# EAGLE schematic ab_sch (EAGLE 6.6.0)
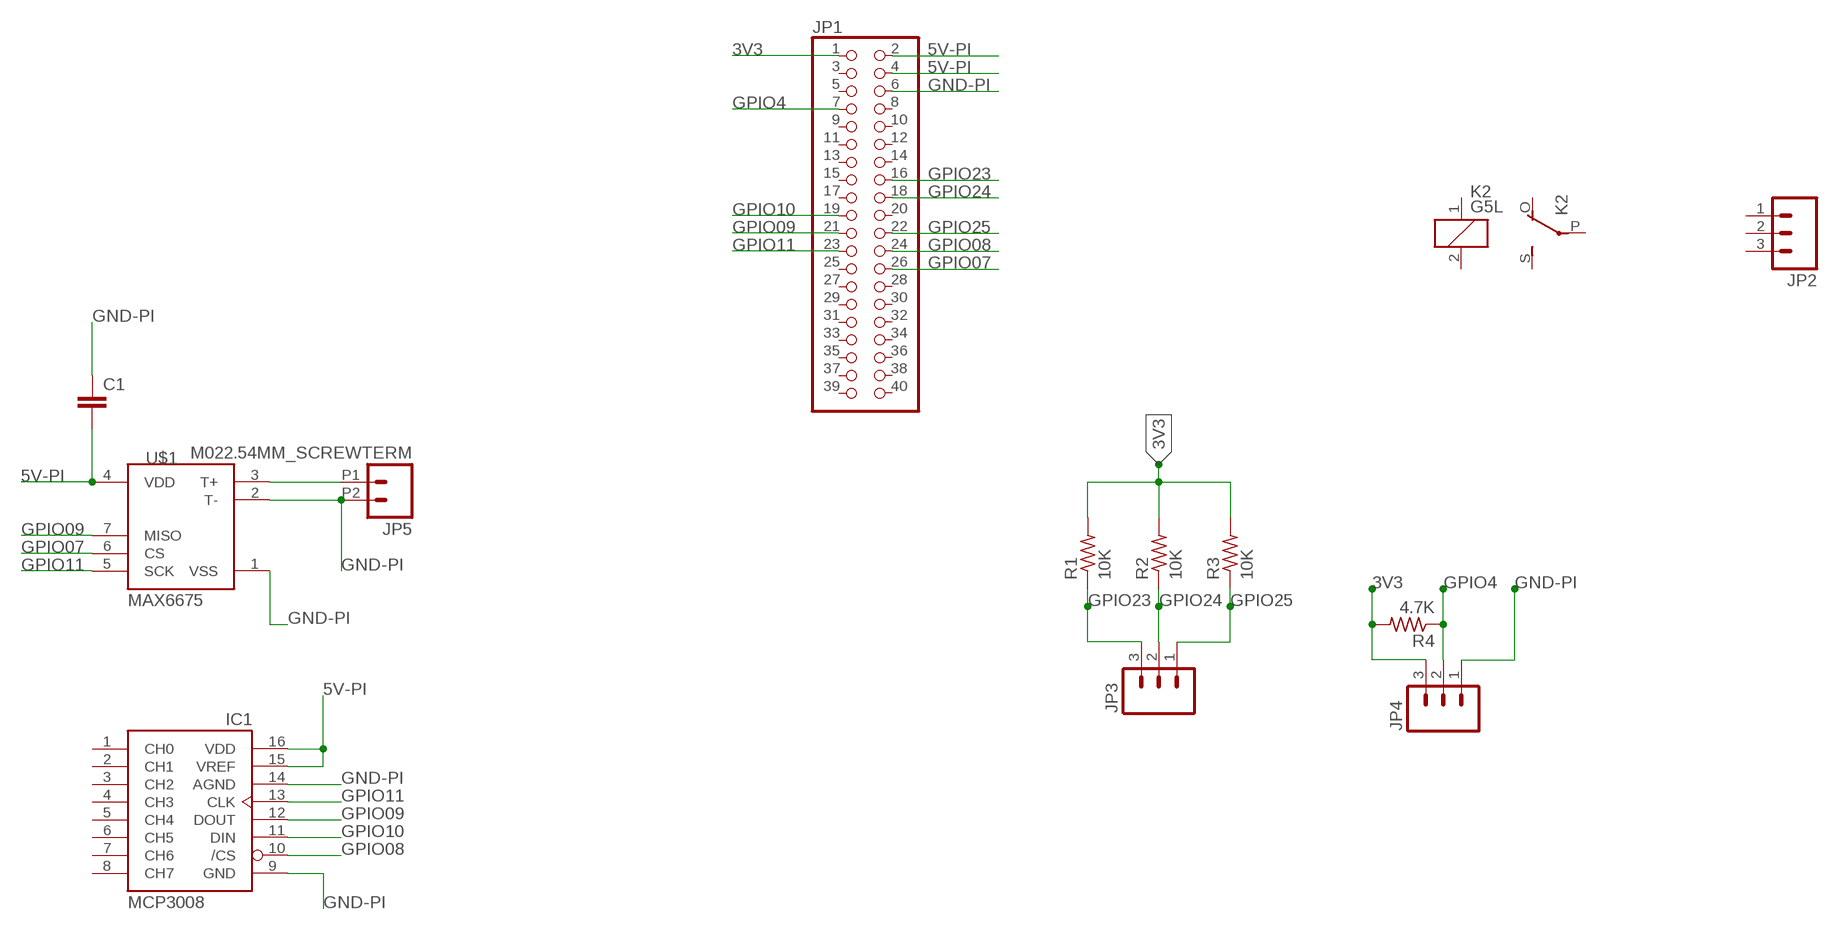
[diagram p0: schematic, sheet 1]

## Parts
C1  CAPKIT  [CAP-PTH-SMALL-KIT]
IC1  MCP3008  [DIL16]
JP1  PINHD-2X20  [2X20]
JP2  M03SCREW  [SCREWTERMINAL-3.5MM-3]
JP3  M03SCREW  [SCREWTERMINAL-3.5MM-3]
JP4  M03SCREW  [SCREWTERMINAL-3.5MM-3]
JP5  M022.54MM_SCREWTERM  [1X02_2.54_SCREWTERM]
K2  G5L  [G5LE]
R1  10K  R-US_0207/10  [0207/10]
R2  10K  R-US_0207/10  [0207/10]
R3  10K  R-US_0207/10  [0207/10]
R4  4.7K  R-US_0207/10  [0207/10]
U$1  MAX6675  [SO08-MAX6675]

## Nets
3V3: JP1.1(3V3) JP4.3 R1.2 R2.2 R3.2 R4.2
5V-PI: C1.2 IC1.15(VREF) IC1.16(VDD) JP1.2 JP1.4 U$1.4(VDD)
GND-PI: C1.1 IC1.9(GND) IC1.14(AGND) JP1.6 JP4.1 JP5.P2 U$1.1(VSS) U$1.2(T-)
GPIO4: JP1.7 JP4.2 R4.1
GPIO07: JP1.26 U$1.6(CS)
GPIO08: IC1.10(/CS) JP1.24
GPIO09: IC1.12(DOUT) JP1.21 U$1.7(MISO)
GPIO10: IC1.11(DIN) JP1.19
GPIO11: IC1.13(CLK) JP1.23 U$1.5(SCK)
GPIO23: JP1.16 JP3.3 R1.1
GPIO24: JP1.18 JP3.2 R2.1
GPIO25: JP1.22 JP3.1 R3.1
N$1: JP5.P1 U$1.3(T+)
Unconnected: IC1.1(CH0) IC1.2(CH1) IC1.3(CH2) IC1.4(CH3) IC1.5(CH4) IC1.6(CH5) IC1.7(CH6) IC1.8(CH7) JP1.3 JP1.5 JP1.8 JP1.9 JP1.10 JP1.11 JP1.12 JP1.13 JP1.14 JP1.15 JP1.17 JP1.20 JP1.25 JP1.27 JP1.28 JP1.29 JP1.30 JP1.31 JP1.32 JP1.33 JP1.34 JP1.35 JP1.36 JP1.37 JP1.38 JP1.39 JP1.40 JP2.1 JP2.2 JP2.3 K2.1 K2.2 K2.O(2:O) K2.P(2:P) K2.S(2:S)

## Library data of the parts
C1 = SparkFun-Capacitors:CAP: Capacitor Standard 0603 ceramic capacitor, and 0.1" leaded capacitor.
IC1 = adafruit:MCP3008
JP1 = pinhead:PINHD-2X20: PIN HEADER
JP2-JP4 = SparkFun-Connectors:M03: Header 3 Standard 3-pin 0.1" header. Use with straight break away headers (SKU : PRT-00116), right angle break away headers (PRT-00553), swiss pins (PRT-00743), machine pins (PRT-00117), and female headers (PRT-00115). Molex polarized connector foot print use with SKU : PRT-08232 with associated crimp pins and housings.
JP5 = SparkFun-Connectors:M02: Standard 2-pin 0.1" header. Use with - straight break away headers ( PRT-00116) - right angle break away headers (PRT-00553) - swiss pins (PRT-00743) - machine pins (PRT-00117) - female headers (PRT-00115) Molex polarized connector foot print use with: PRT-08233 with associated crimp pins and housings. 2.54_SCREWTERM for use with PRT-10571. 3.5mm Screw Terminal footprints for PRT-08084 5mm Screw Terminal footprints for use with PRT-08432
K2 = relay:G5L: RELAY 1 x switch, 10 A/120 V AC, 8 A/30 V ADC, Omron; OC_FARNELL: unknown; OC_NEWARK: unknown
R1-R4 = resistor:R-US_: RESISTOR, American symbol
U$1 = SparkFun-AnalogIC:MAX6675: K-type thermocouple ADC, SPI output